# EAGLE design Convertidor32Lineas (EAGLE 7.2.0)
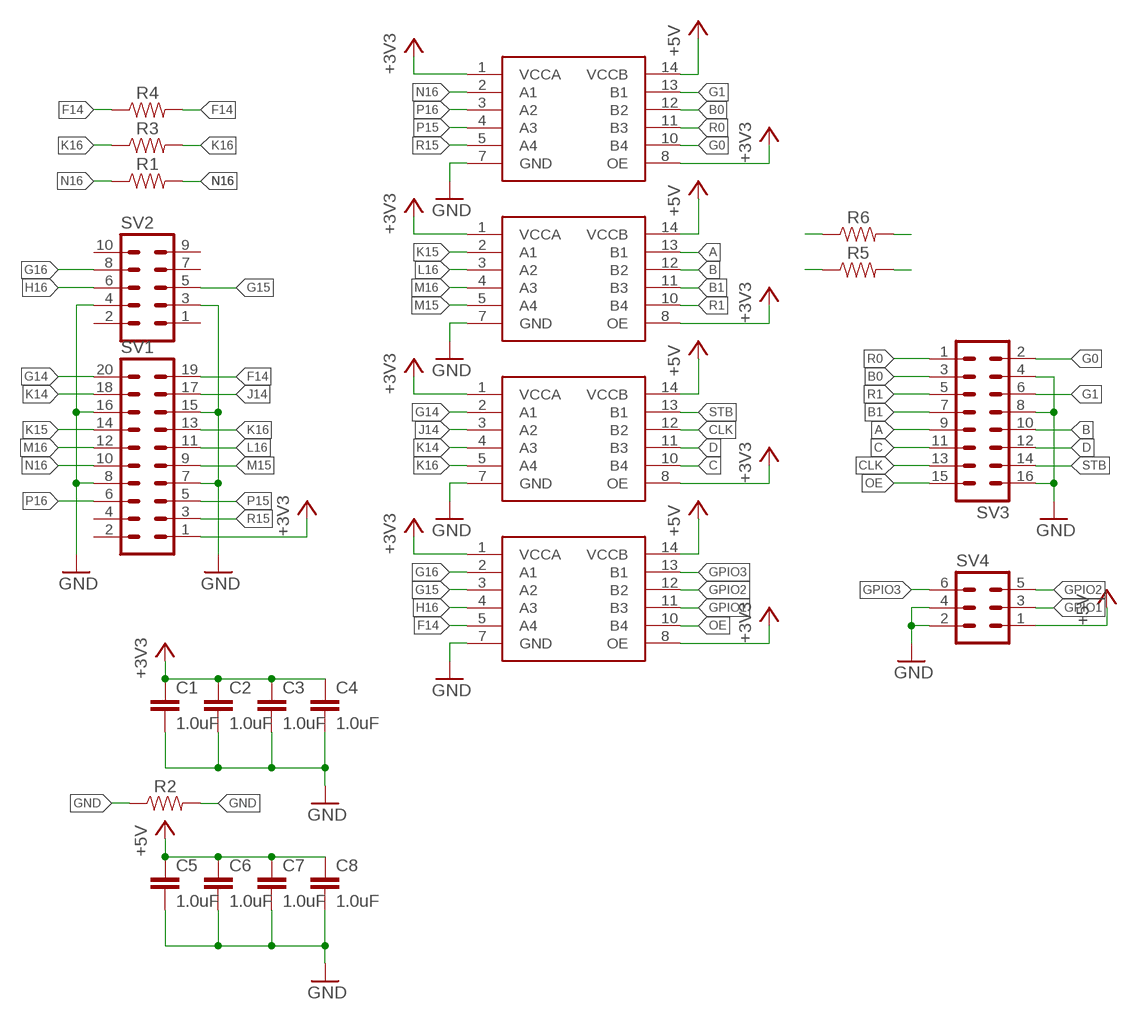
[diagram p0: schematic, sheet 1]

## Parts
C1  1.0uF  1.0UF-0805-25V-(+80/-20%)  [0805]
C2  1.0uF  1.0UF-0805-25V-(+80/-20%)  [0805]
C3  1.0uF  1.0UF-0805-25V-(+80/-20%)  [0805]
C4  1.0uF  1.0UF-0805-25V-(+80/-20%)  [0805]
C5  1.0uF  1.0UF-0805-25V-(+80/-20%)  [0805]
C6  1.0uF  1.0UF-0805-25V-(+80/-20%)  [0805]
C7  1.0uF  1.0UF-0805-25V-(+80/-20%)  [0805]
C8  1.0uF  1.0UF-0805-25V-(+80/-20%)  [0805]
IC1  TXB0104  [SO14]
IC2  TXB0104  [SO14]
IC3  TXB0104  [SO14]
IC4  TXB0104  [SO14]
R1  RESISTOR0805  [0805]
R2  RESISTOR0805  [0805]
R3  RESISTOR0805  [0805]
R4  RESISTOR0805  [0805]
R5  RESISTOR0805  [0805]
R6  RESISTOR0805  [0805]
SV1  MA10-2  [MA10-2]
SV2  MA05-2  [MA05-2]
SV3  MA08-2  [MA08-2]
SV4  MA03-2  [MA03-2]

## Nets
+3V3: C1.1 C2.1 C3.1 C4.1 IC1.1(VCCA) IC1.8(OE) IC2.1(VCCA) IC2.8(OE) IC3.1(VCCA) IC3.8(OE) IC4.1(VCCA) IC4.8(OE) SV1.1
+5V: C5.1 C6.1 C7.1 C8.1 IC1.14(VCCB) IC2.14(VCCB) IC3.14(VCCB) IC4.14(VCCB) SV4.1
A: IC2.13(B1) SV3.9
B: IC2.12(B2) SV3.10
B0: IC1.12(B2) SV3.3
B1: IC2.11(B3) SV3.7
C: IC3.10(B4) SV3.11
CLK: IC3.12(B2) SV3.13
D: IC3.11(B3) SV3.12
F14: IC4.5(A4) R4.1 R4.2 SV1.19
G0: IC1.10(B4) SV3.2
G1: IC1.13(B1) SV3.6
G14: IC3.2(A1) SV1.20
G15: IC4.3(A2) SV2.5
G16: IC4.2(A1) SV2.8
GND: C1.2 C2.2 C3.2 C4.2 C5.2 C6.2 C7.2 C8.2 IC1.7(GND) IC2.7(GND) IC3.7(GND) IC4.7(GND) R2.1 R2.2 SV1.7 SV1.8 SV1.15 SV1.16 SV2.3 SV2.4 SV3.4 SV3.8 SV3.16 SV4.2 SV4.4
GPIO1: IC4.11(B3) SV4.3
GPIO2: IC4.12(B2) SV4.5
GPIO3: IC4.13(B1) SV4.6
H16: IC4.4(A3) SV2.6
J14: IC3.3(A2) SV1.17
K14: IC3.4(A3) SV1.18
K15: IC2.2(A1) SV1.14
K16: IC3.5(A4) R3.1 R3.2 SV1.13
L16: IC2.3(A2) SV1.11
M15: IC2.5(A4) SV1.9
M16: IC2.4(A3) SV1.12
N16: IC1.2(A1) R1.1 R1.2 SV1.10
OE: IC4.10(B4) R6.1 R6.2 SV3.15
P15: IC1.4(A3) SV1.5
P16: IC1.3(A2) SV1.6
R0: IC1.11(B3) SV3.1
R1: IC2.10(B4) R5.1 R5.2 SV3.5
R15: IC1.5(A4) SV1.3
STB: IC3.13(B1) SV3.14
Unconnected: SV1.2 SV1.4 SV2.1 SV2.2 SV2.7 SV2.9 SV2.10

## Library data of the parts
C1-C8 = SparkFun-Capacitors:1.0UF: 1µF ceramic capacitors A capacitor is a passive two-terminal electrical component used to store electrical energy temporarily in an electric field.; PROD_ID: CAP-11625
IC1-IC4 = Componentes:TXB0104
R1-R6 = SparkFun-Resistors:RESISTOR: Generic Resistor Package
SV1 = con-lstb:MA10-2: PIN HEADER; OC_FARNELL: unknown; OC_NEWARK: unknown
SV2 = con-lstb:MA05-2: PIN HEADER; OC_FARNELL: unknown; OC_NEWARK: unknown
SV3 = con-lstb:MA08-2: PIN HEADER; OC_FARNELL: unknown; OC_NEWARK: unknown
SV4 = con-lstb:MA03-2: PIN HEADER; OC_FARNELL: unknown; OC_NEWARK: unknown

## Board
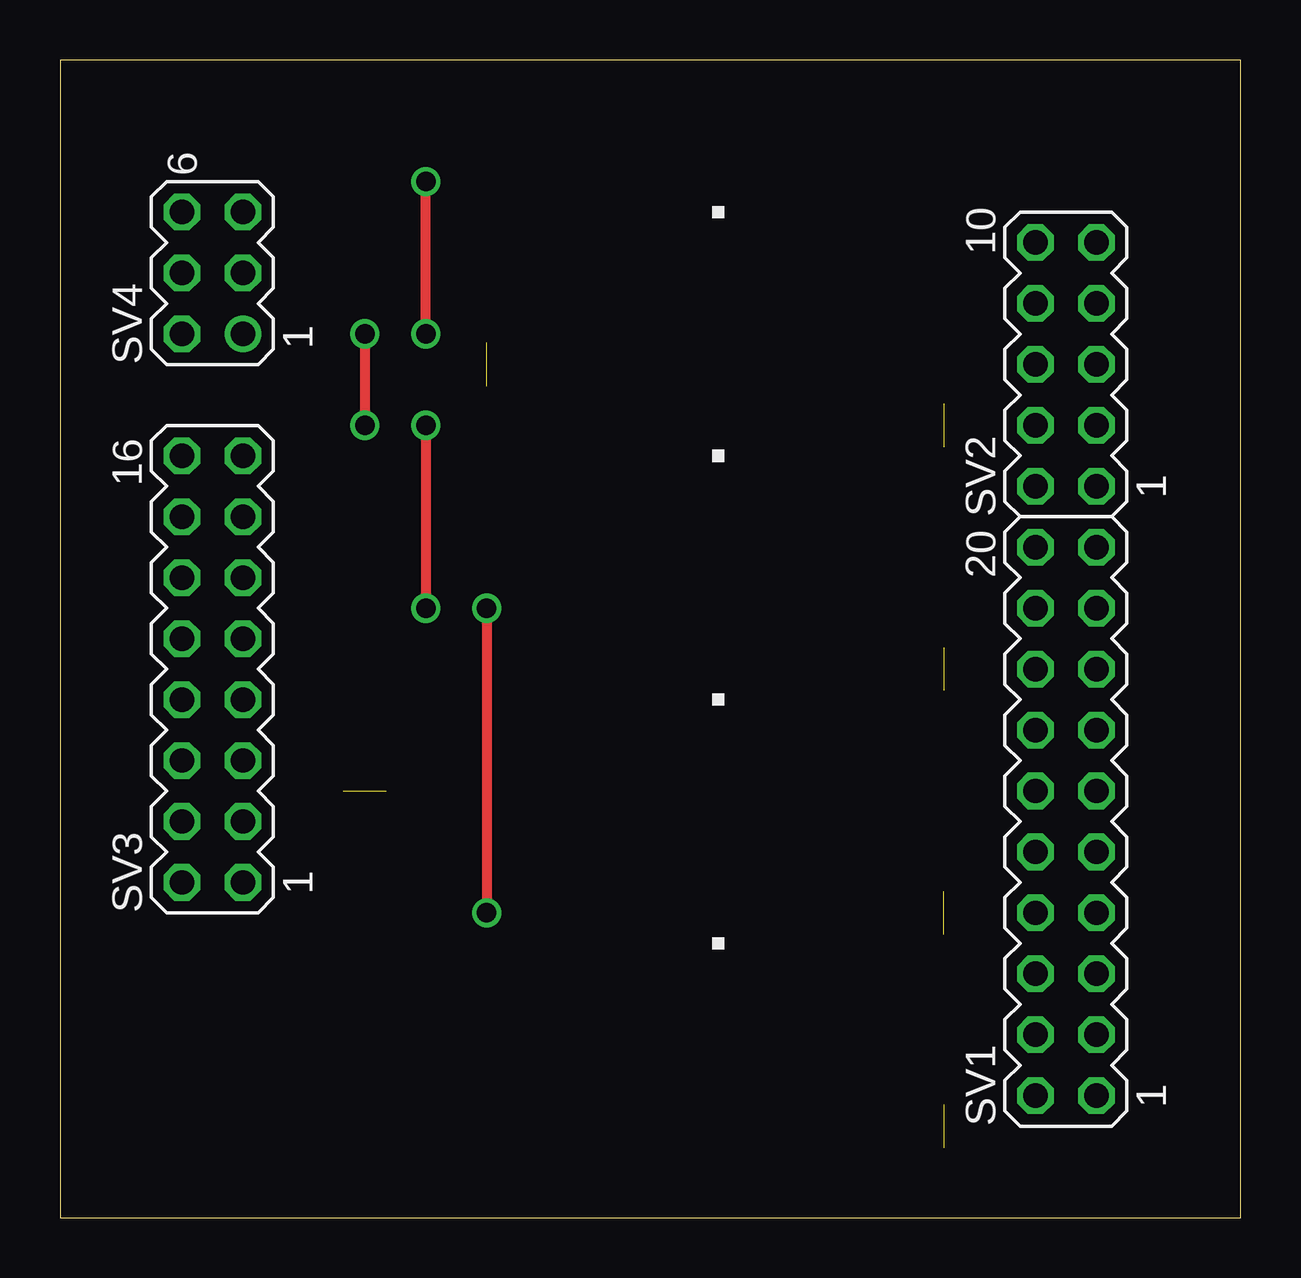
[diagram p1: board, top side]
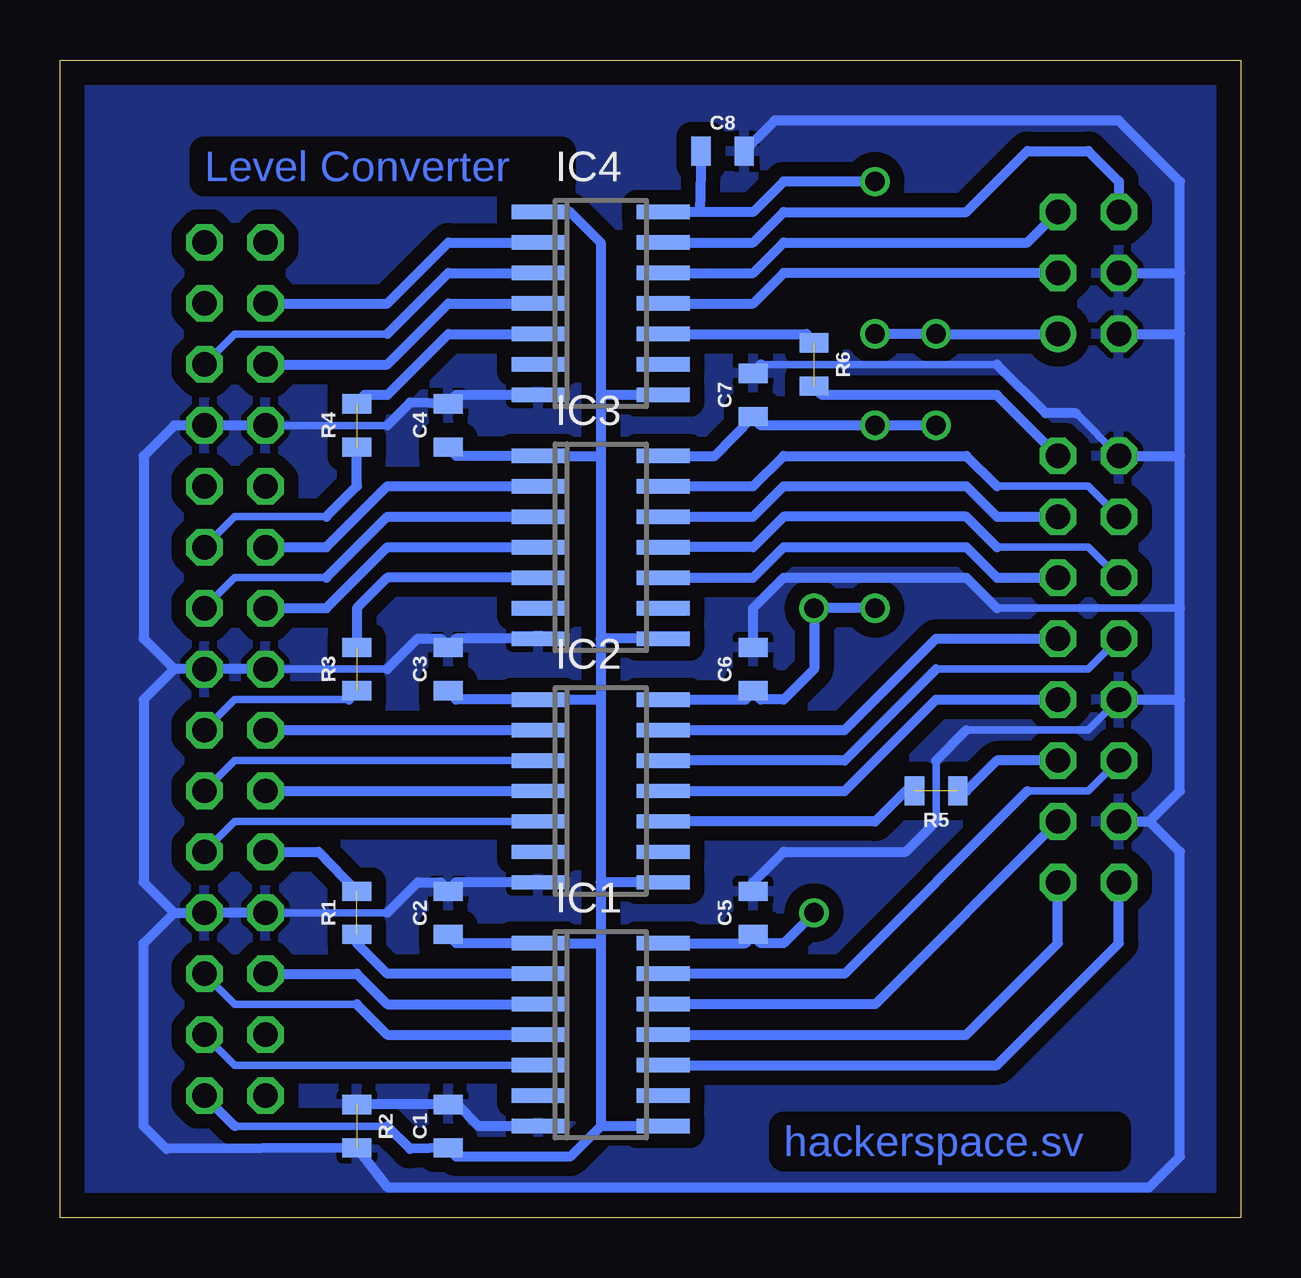
[diagram p2: board, bottom side, seen from below]

Size 49.2 x 48.25 mm. Coordinates in mm from the lower left corner, seen from the top.
Outline: 0,0 49.2,0 49.2,48.25 0,48.25 0,0
Copper layers (1*16): Top 0.035mm / dielectric 1.5mm / Bottom 0.035mm
Design rules "default": minimum track width 10mil, minimum drill 24mil, track to track 8mil, track to pad 8mil, pad to pad 8mil, via to via 8mil, smd to smd 8mil, copper to edge 40mil, drill to drill 8mil, minimum pad ring 10mil, minimum via ring 8mil, stop-mask expansion 4mil, vias tented up to drill 0mil, thermal gap 10mil

### Footprints (pad centres in the part's own frame; a part is rotated, then mirrored left to right if it is on the bottom)
0805 = smd 0.8 x 1.2: 1 -0.9,0; 2 0.9,0
SO14 = smd 0.6 x 2.2: 1 -3.81,-2.6; 2 -2.54,-2.6; 3 -1.27,-2.6; 4 0,-2.6; 5 1.27,-2.6; 6 2.54,-2.6; 7 3.81,-2.6; 8 3.81,2.6; 9 2.54,2.6; 10 1.27,2.6; 11 0,2.6; 12 -1.27,2.6; 13 -2.54,2.6; 14 -3.81,2.6
MA10-2 = drill 1.016 octagon: 1 -11.43,-1.27; 2 -11.43,1.27; 3 -8.89,-1.27; 4 -8.89,1.27; 5 -6.35,-1.27; 6 -6.35,1.27; 7 -3.81,-1.27; 8 -3.81,1.27; 9 -1.27,-1.27; 10 -1.27,1.27; 11 1.27,-1.27; 12 1.27,1.27; 13 3.81,-1.27; 14 3.81,1.27; 15 6.35,-1.27; 16 6.35,1.27; 17 8.89,-1.27; 18 8.89,1.27; 19 11.43,-1.27; 20 11.43,1.27
MA05-2 = drill 1.016 octagon: 1 -5.08,-1.27; 2 -5.08,1.27; 3 -2.54,-1.27; 4 -2.54,1.27; 5 0,-1.27; 6 0,1.27; 7 2.54,-1.27; 8 2.54,1.27; 9 5.08,-1.27; 10 5.08,1.27
MA08-2 = drill 1.016 octagon: 1 -8.89,-1.27; 2 -8.89,1.27; 3 -6.35,-1.27; 4 -6.35,1.27; 5 -3.81,-1.27; 6 -3.81,1.27; 7 -1.27,-1.27; 8 -1.27,1.27; 9 1.27,-1.27; 10 1.27,1.27; 11 3.81,-1.27; 12 3.81,1.27; 13 6.35,-1.27; 14 6.35,1.27; 15 8.89,-1.27; 16 8.89,1.27
MA03-2 = drill 1.016: 1 -2.54,-1.27 | drill 1.016 octagon: 2 -2.54,1.27; 3 0,-1.27; 4 0,1.27; 5 2.54,-1.27; 6 2.54,1.27

### Placement (x,y rotation side)
C1  33.02,3.81 90 bottom
C2  33.02,12.7 90 bottom
C3  33.02,22.86 90 bottom
C4  33.02,33.02 90 bottom
C5  20.32,12.7 90 bottom
C6  20.32,22.86 90 bottom
C7  20.32,34.29 90 bottom
C8  21.59,44.45 0 bottom
IC1  26.67,7.62 270 bottom
IC2  26.67,17.78 270 bottom
IC3  26.67,27.94 270 bottom
IC4  26.67,38.1 270 bottom
R1  36.83,12.7 90 bottom
R2  36.83,3.81 270 bottom
R3  36.83,22.86 90 bottom
R4  36.83,33.02 90 bottom
R5  12.7,17.78 180 bottom
R6  17.78,35.56 270 bottom
SV1  41.91,16.51 90 top
SV2  41.91,35.56 90 top
SV3  6.35,22.86 90 top
SV4  6.35,39.37 90 top

### Tracks (layer width: path | path; a pad name or v marks a point on that pad's centre or on a via)
+3V3
  Bottom 0.305: 35.56,3.81 41.91,3.81
  Bottom 0.406: IC4.1 27.94,41.91 26.67,40.64 26.67,34.29 | 26.67,34.29 26.67,31.75 | 26.67,31.75 26.67,24.13 | 26.67,24.13 26.67,21.59 | 26.67,21.59 26.67,13.97 | 26.67,13.97 26.67,11.43 | 26.67,11.43 26.67,3.81 | 26.67,3.81 27.94,2.54 32.7,2.54 C1.1 34.61,2.86 35.56,3.81 | IC1.8 26.67,3.81 | 26.67,11.43 IC1.1 32.7,11.43 C2.1 | IC2.8 26.67,13.97 | 26.67,21.59 IC2.1 32.7,21.59 C3.1 | 26.67,31.75 IC3.1 32.7,31.75 C4.1 | IC4.8 26.67,34.29 | 41.91,3.81 SV1.1 | IC3.8 26.67,24.13
+5V  (via drill 0.81)
  Top 0.406: v15.24,33.02 v15.24,25.4 | v17.78,25.4 v17.78,12.7 | v15.24,36.83 v15.24,43.18 | v12.7,36.83 v12.7,33.02
  Bottom 0.406: IC1.14 20.64,11.43 C5.1 20,11.43 19.05,11.43 v17.78,12.7 | IC2.14 20.64,21.59 C6.1 20,21.59 19.05,21.59 17.78,22.86 v17.78,25.4 v15.24,25.4 | IC3.14 21.91,31.75 C7.1 20,33.02 v15.24,33.02 v12.7,33.02 | v15.24,36.83 v12.7,36.83 SV4.1 | v15.24,43.18 19.05,43.18 20.32,41.91 22.54,41.91 | 22.54,41.91 IC4.14 | C8.1 22.54,41.91
A
  Bottom 0.406: IC2.13 16.51,20.32 12.7,24.13 SV3.9
B
  Bottom 0.305: SV3.10 6.35,22.86 12.7,22.86
  Bottom 0.406: 12.7,22.86 16.51,19.05 IC2.12
B0
  Bottom 0.406: SV3.3 15.24,8.89 IC1.12
B1
  Bottom 0.406: IC2.11 16.51,17.78 12.7,21.59 SV3.7
C
  Bottom 0.406: IC3.10 20.32,26.67 19.05,27.94 11.43,27.94 10.16,26.67 SV3.11
CLK
  Bottom 0.406: IC3.12 20.32,29.21 19.05,30.48 11.43,30.48 10.16,29.21 SV3.13
D
  Bottom 0.305: SV3.12 6.35,27.94 10.16,27.94
  Bottom 0.406: 10.16,27.94 11.43,29.21 19.05,29.21 20.32,27.94 IC3.11
F14  (1 unrouted)
  Bottom 0.305: SV1.19 41.91,29.21 38.1,29.21
  Bottom 0.406: IC4.5 33.02,36.83 35.56,34.29 36.51,34.29 R4.2 | 38.1,29.21 36.83,30.48 R4.1
G0
  Bottom 0.406: IC1.10 10.16,6.35 5.08,11.43 SV3.2
G1
  Bottom 0.305: SV3.6 6.35,17.78 8.89,17.78
  Bottom 0.406: 8.89,17.78 16.51,10.16 IC1.13
G14
  Bottom 0.406: SV1.20 38.1,27.94 35.56,30.48 IC3.2
G15
  Bottom 0.305: SV2.5 41.91,36.83 35.56,36.83
  Bottom 0.406: 35.56,36.83 33.02,39.37 IC4.3
G16
  Bottom 0.406: SV2.8 35.56,38.1 33.02,40.64 IC4.2
GND  (1 unrouted)
  Bottom 0.305: SV1.8 35.56,12.7 | SV1.16 35.56,22.86 | 35.56,33.02 SV2.4 | 12.7,16.51 12.7,19.05 | 11.43,20.32 6.35,20.32 SV3.8 | 10.16,25.4 2.54,25.4 | SV3.16 6.86,33.53 | 10.16,35.56 20,35.56
  Bottom 0.406: SV1.8 SV1.7 44.45,12.7 | R2.1 C1.2 32.65,4.71 31.75,3.81 IC1.7 | 44.45,12.7 45.72,11.43 45.72,3.81 44.77,2.86 R2.2 35.56,1.27 3.81,1.27 2.54,2.54 2.54,15.24 3.81,16.51 | 35.56,12.7 34.29,13.97 33.34,13.97 C2.2 32.7,13.97 IC2.7 | IC3.7 32.7,24.13 C3.2 33.34,24.13 34.29,24.13 35.56,22.86 | IC4.7 32.7,34.29 C4.2 34.61,33.97 35.56,33.02 | 44.45,22.86 SV1.15 SV1.16 | 44.45,22.86 45.72,21.59 45.72,13.97 44.45,12.7 | 44.45,22.86 45.72,24.13 45.72,31.75 44.45,33.02 SV2.3 SV2.4 | SV3.4 3.81,16.51 | 3.81,16.51 2.54,17.78 2.54,21.59 | 2.54,21.59 2.54,25.4 2.54,31.75 | 2.54,31.75 2.54,36.83 | 2.54,36.83 2.54,39.37 | 2.54,39.37 2.54,43.18 5.08,45.72 19.42,45.72 C8.2 | SV3.16 2.54,31.75 | SV3.8 2.54,21.59 | C5.2 20.32,13.97 19.05,15.24 13.97,15.24 12.7,16.51 | 12.7,19.05 11.43,20.32 | C6.2 20.32,25.4 19.05,26.67 11.43,26.67 10.16,25.4 | 20,35.56 C7.2 | 6.86,33.53 8.13,33.53 10.16,35.56 | SV4.2 2.54,36.83 | SV4.4 2.54,39.37
  pour Bottom (isolate 0.61): 0,0 0,48.26 49.53,48.26 49.53,0
GPIO1
  Bottom 0.406: IC4.11 20.32,38.1 19.05,39.37 SV4.3
GPIO2
  Bottom 0.406: IC4.12 20.32,39.37 19.05,40.64 8.89,40.64 SV4.5
GPIO3
  Bottom 0.406: IC4.13 20.32,40.64 19.05,41.91 11.43,41.91 8.89,44.45 6.35,44.45 5.08,43.18 SV4.6
H16
  Bottom 0.406: SV2.6 35.56,35.56 33.02,38.1 IC4.4
J14
  Bottom 0.305: SV1.17 41.91,26.67 38.1,26.67
  Bottom 0.406: 38.1,26.67 35.56,29.21 IC3.3
K14
  Bottom 0.406: SV1.18 38.1,25.4 35.56,27.94 IC3.4
K15
  Bottom 0.406: SV1.14 IC2.2
K16  (1 unrouted)
  Bottom 0.305: SV1.13 41.91,21.59 37.15,21.59
  Bottom 0.406: 37.15,21.59 R3.1 | IC3.5 35.56,26.67 36.83,25.4 R3.2
L16
  Bottom 0.305: SV1.11 41.91,19.05 IC2.3
M15
  Bottom 0.305: SV1.9 41.91,16.51 IC2.5
M16
  Bottom 0.406: SV1.12 IC2.4
N16  (1 unrouted)
  Bottom 0.406: IC1.2 35.56,10.16 36.83,11.43 R1.1 | SV1.10 38.42,15.24 R1.2
OE  (1 unrouted)
  Bottom 0.406: SV3.15 10.16,34.29 17.46,34.29 R6.2 | IC4.10 18.1,36.83 R6.1
P15
  Bottom 0.305: SV1.5 41.91,8.89 36.83,8.89
  Bottom 0.406: 36.83,8.89 35.56,7.62 IC1.4
P16
  Bottom 0.406: SV1.6 36.83,10.16 35.56,8.89 IC1.3
R0
  Bottom 0.406: IC1.11 11.43,7.62 7.62,11.43 SV3.1
R1  (1 unrouted)
  Bottom 0.406: SV3.5 10.16,19.05 11.43,17.78 R5.1 | R5.2 13.97,17.78 15.24,16.51 IC2.10
R15
  Bottom 0.305: SV1.3 41.91,6.35 IC1.5
STB
  Bottom 0.305: SV3.14 6.35,30.48 10.16,30.48
  Bottom 0.406: 10.16,30.48 11.43,31.75 19.05,31.75 20.32,30.48 IC3.13

### Text on the board
Bottom: Level Converter | hackerspace.sv